# Altium schematic sheet OBC ARM.SchDoc
size A1; SheetNumber: 1; SheetTotal: 1
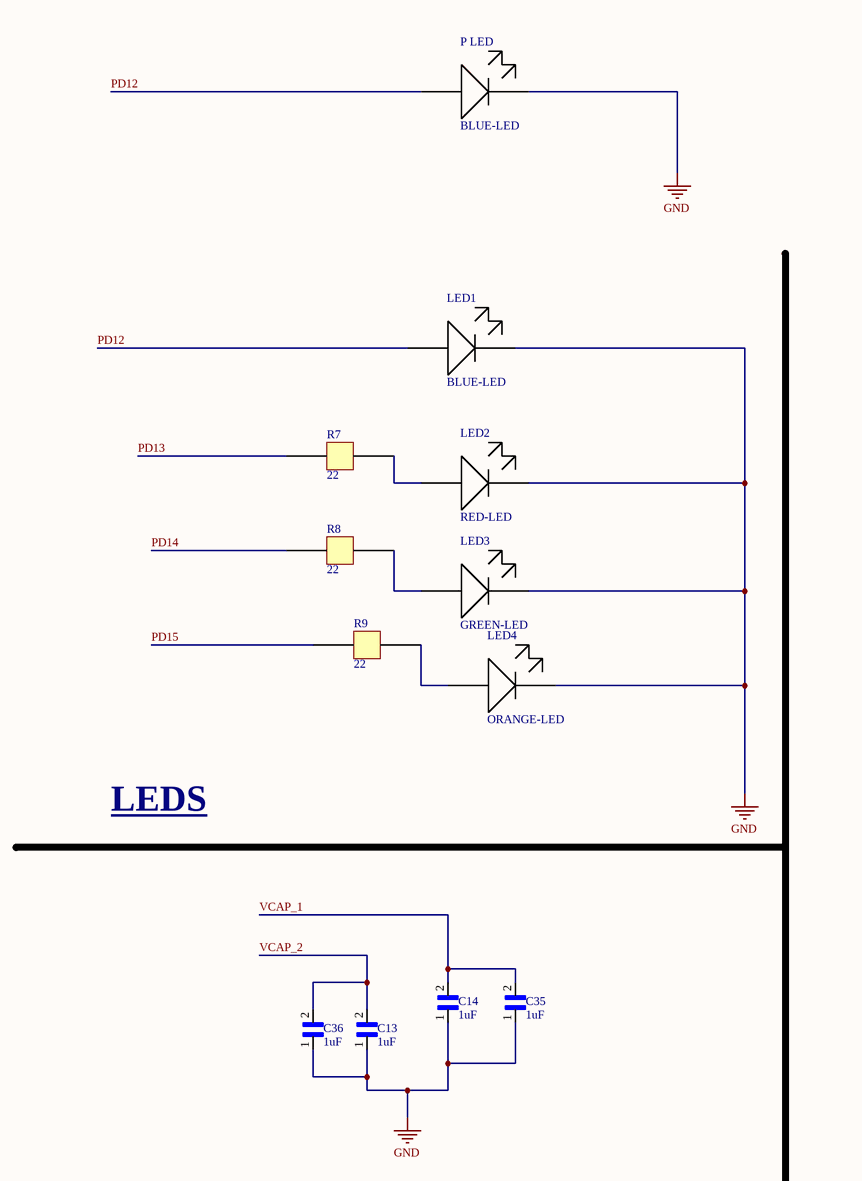
[diagram p0: OBC ARM.SchDoc, top left]
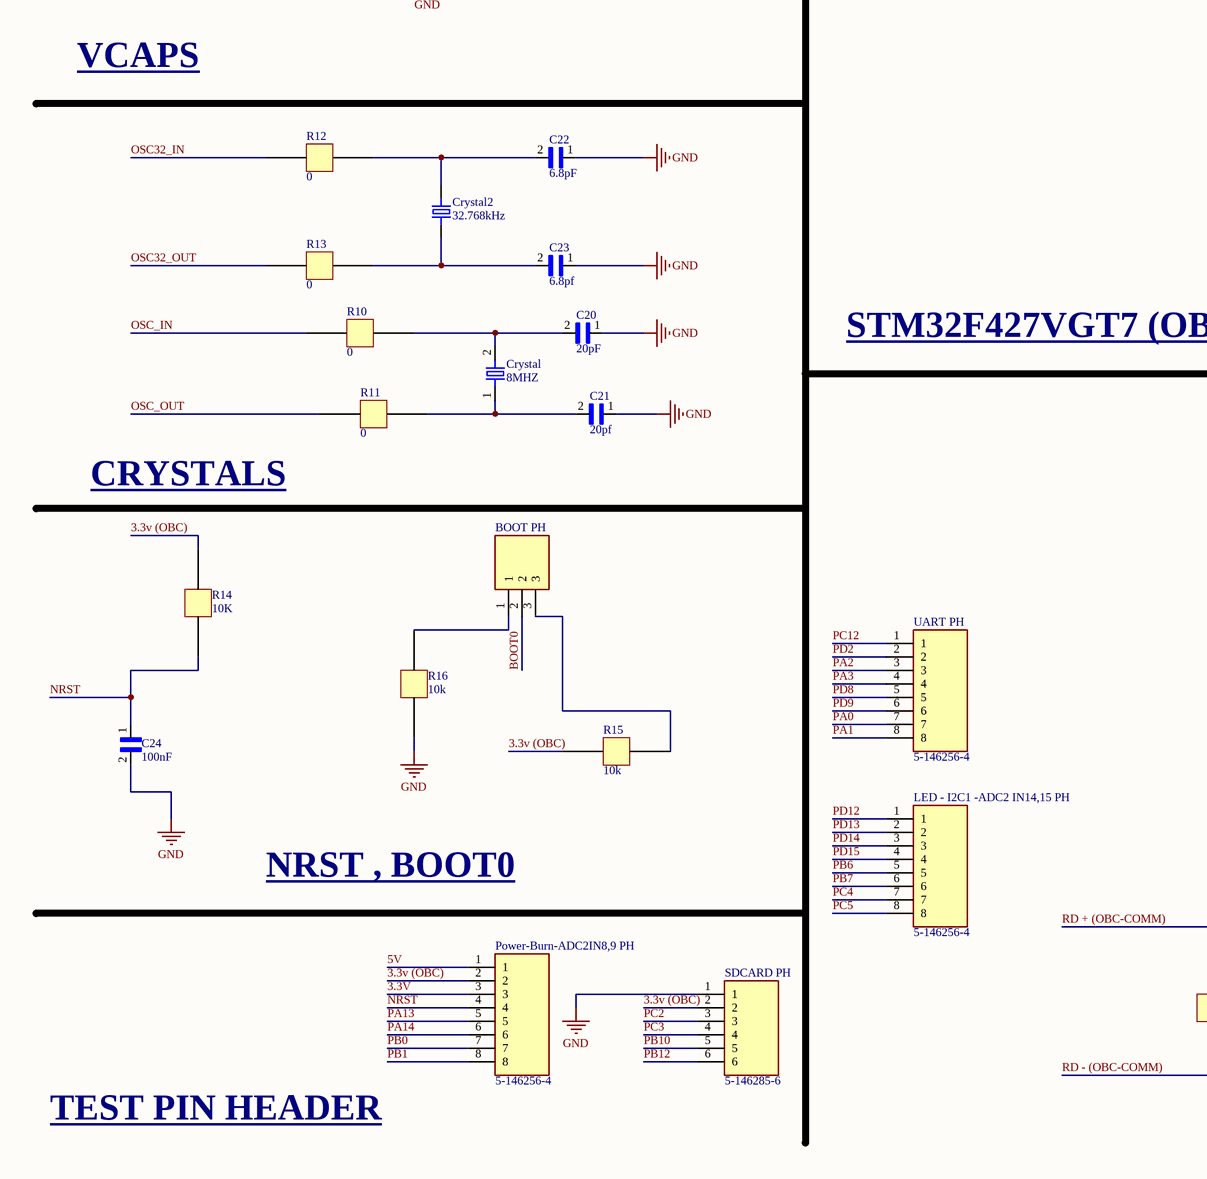
[diagram p1: OBC ARM.SchDoc, bottom left]
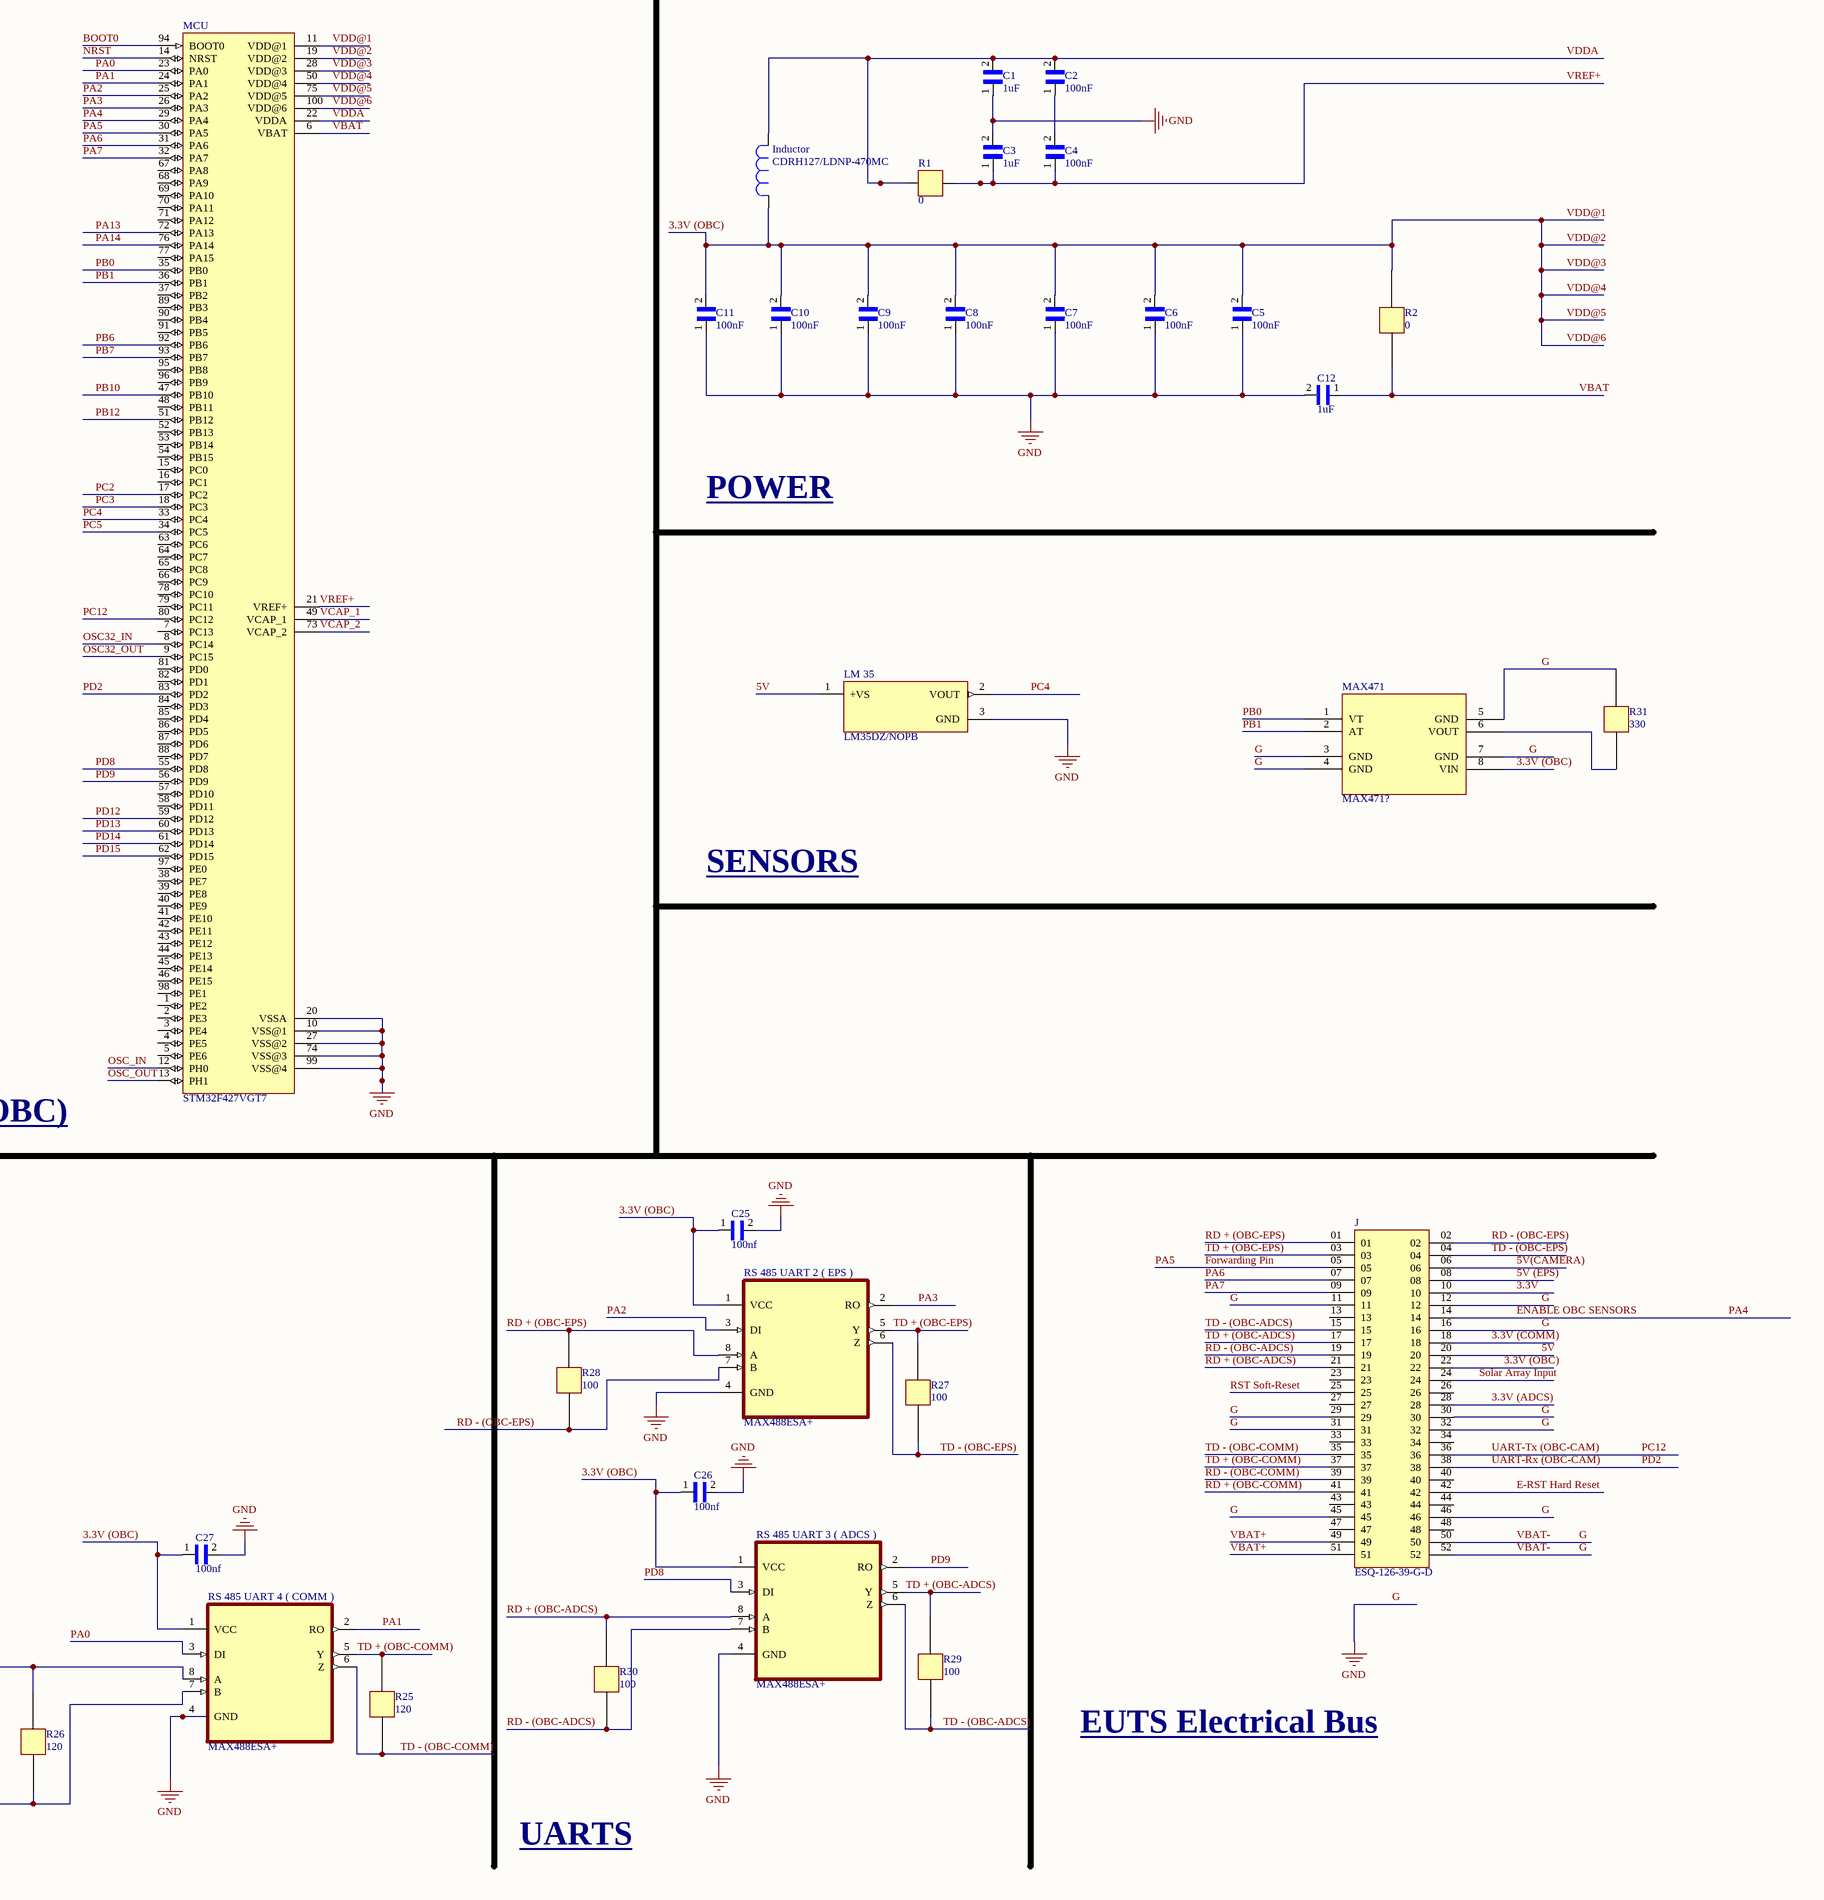
[diagram p2: OBC ARM.SchDoc, bottom right]

## Parts
BOOT_PH  4-103327-5  [TE_4-103327-5]  (value not drawn)
C1  1uF  [CAPC2012X95N]
C2  100nF  [CAPC2012X95N]
C3  1uF  [CAPC2012X95N]
C4  100nF  [CAPC2012X95N]
C5  100nF  [CAPC2012X95N]
C6  100nF  [CAPC2012X95N]
C7  100nF  [CAPC2012X95N]
C8  100nF  [CAPC2012X95N]
C9  100nF  [CAPC2012X95N]
C10  100nF  [CAPC2012X95N]
C11  100nF  [CAPC2012X95N]
C12  1uF  [CAPC2012X95N]
C13  1uF  [CAPC2012X95N]
C14  1uF  [CAPC2012X95N]
C20  20pF  [CAPC2012X95N]
C21  20pf  [CAPC2012X95N]
C22  6.8pF  [CAPC2012X95N]
C23  6.8pf  [CAPC2012X95N]
C24  100nF  [CAPC2012X95N]
C25  100nf  [CAPC2012X95N]
C26  100nf  [CAPC2012X95N]
C27  100nf  [CAPC2012X95N]
C35  1uF  [CAPC2012X95N]
C36  1uF  [CAPC2012X95N]
Crystal  8MHZ  [XTAL500X320X130N]
Crystal2  32.768kHz  [XTAL_ECS-.327-12.5-34S-TR]
Inductor  CDRH127/LDNP-470MC  [IND_CDRH127/LDNP-470MC_SUM]
J  ESQ-126-39-G-D  [SAMTEC_ESQ-126-39-G-D]
LED1  BLUE-LED  [RESC3015X65]
LED2  RED-LED  [RESC3015X65]
LED3  GREEN-LED  [RESC3015X65]
LED4  ORANGE-LED  [RESC3015X65]
LED_-_I2C1_-ADC2_IN14,15_PH  5-146256-4  [TE_5-146256-4]
LM_35  LM35DZ/NOPB  [TO92127P521H735-3]
MAX471  MAX471?  [PCBComponent_1]
MCU  STM32F427VGT7  [QFP50P1600X1600X160-100N]
P_LED  BLUE-LED  [RESC3015X65]
Power-Burn-ADC2IN8,9_PH  5-146256-4  [TE_5-146256-4]
R1  0  [CAPC2012X95N]
R2  0  [CAPC2012X95N]
R7  22  [CAPC2012X95N]
R8  22  [CAPC2012X95N]
R9  22  [CAPC2012X95N]
R10  0  [CAPC2012X95N]
R11  0  [CAPC2012X95N]
R12  0  [CAPC2012X95N]
R13  0  [CAPC2012X95N]
R14  10K  [CAPC2012X95N]
R15  10k  [CAPC2012X95N]
R16  10k  [CAPC2012X95N]
R25  120  [CAPC2012X95N]
R26  120  [CAPC2012X95N]
R27  100  [CAPC2012X95N]
R28  100  [CAPC2012X95N]
R29  100  [CAPC2012X95N]
R30  100  [CAPC2012X95N]
R31  330  [CAPC2012X95N]
RS_485_UART_2_(_EPS_)  MAX488ESA+  [SOIC127P600X175-8N]
RS_485_UART_3_(_ADCS_)  MAX488ESA+  [SOIC127P600X175-8N]
RS_485_UART_4_(_COMM_)  MAX488ESA+  [SOIC127P600X175-8N]
SDCARD_PH  5-146285-6  [TE_5-146285-6]
UART_PH  5-146256-4  [TE_5-146256-4]

## Nets
G: C1.1 C3.2 C5.1 C6.1 C7.1 C8.1 C9.1 C10.1 C11.1 C12.2 C13.1 C14.1 C20.1 C21.1 C22.1 C23.1 C24.2 C25.2 C26.2 C27.2 C35.1 C36.1 J.11 J.12 J.16 J.29 J.30 J.31 J.32 J.45 J.46 J.50 J.52 LED1.2 LED2.2 LED3.2 LED4.2 LM_35.3(GND) MAX471.3(GND) MAX471.4(GND) MAX471.5(GND) MAX471.7(GND) MCU.10(VSS@1) MCU.20(VSSA) MCU.27(VSS@2) MCU.74(VSS@3) MCU.99(VSS@4) P_LED.2 R16.2 R31.1 RS_485_UART_2_(_EPS_).4(GND) RS_485_UART_3_(_ADCS_).4(GND) RS_485_UART_4_(_COMM_).4(GND) SDCARD_PH.1  [also labelled GND, VBAT-]
3.3V: J.10 Power-Burn-ADC2IN8,9_PH.3
3.3V (ADCS): J.28
3.3V (COMM): J.18
3.3v (OBC): C5.2 C6.2 C7.2 C8.2 C9.2 C10.2 C11.2 C25.1 C26.1 C27.1 Inductor.2 J.22 MAX471.8(VIN) MCU.11(VDD@1) MCU.19(VDD@2) MCU.28(VDD@3) MCU.50(VDD@4) MCU.75(VDD@5) MCU.100(VDD@6) Power-Burn-ADC2IN8,9_PH.2 R2.1 R14.1 R15.2 RS_485_UART_2_(_EPS_).1(VCC) RS_485_UART_3_(_ADCS_).1(VCC) RS_485_UART_4_(_COMM_).1(VCC) SDCARD_PH.2  [also labelled VDD@1, VDD@2, VDD@3, VDD@4, VDD@5, VDD@6]
5V: J.20 LM_35.1(+VS) Power-Burn-ADC2IN8,9_PH.1
5V (EPS): J.08
5V(CAMERA): J.06
BOOT0: BOOT_PH.2 MCU.94(BOOT0)
E-RST Hard Reset: J.42
ENABLE OBC SENSORS: J.14 MCU.29(PA4)  [also labelled PA4]
Forwarding Pin: J.05 MCU.30(PA5)  [also labelled PA5]
NRST: C24.1 MCU.14(NRST) Power-Burn-ADC2IN8,9_PH.4 R14.2
OSC32_IN: MCU.8(PC14) R12.2
OSC32_OUT: MCU.9(PC15) R13.2
OSC_IN: MCU.12(PH0) R10.2
OSC_OUT: MCU.13(PH1) R11.2
PA0: MCU.23(PA0) RS_485_UART_4_(_COMM_).3(DI) UART_PH.7
PA1: MCU.24(PA1) RS_485_UART_4_(_COMM_).2(RO) UART_PH.8
PA2: MCU.25(PA2) RS_485_UART_2_(_EPS_).3(DI) UART_PH.3
PA3: MCU.26(PA3) RS_485_UART_2_(_EPS_).2(RO) UART_PH.4
PA6: J.07 MCU.31(PA6)
PA7: J.09 MCU.32(PA7)
PA13: MCU.72(PA13) Power-Burn-ADC2IN8,9_PH.5
PA14: MCU.76(PA14) Power-Burn-ADC2IN8,9_PH.6
PB0: MAX471.1(VT) MCU.35(PB0) Power-Burn-ADC2IN8,9_PH.7
PB1: MAX471.2(AT) MCU.36(PB1) Power-Burn-ADC2IN8,9_PH.8
PB6: LED_-_I2C1_-ADC2_IN14,15_PH.5 MCU.92(PB6)
PB7: LED_-_I2C1_-ADC2_IN14,15_PH.6 MCU.93(PB7)
PB10: MCU.47(PB10) SDCARD_PH.5
PB12: MCU.51(PB12) SDCARD_PH.6
PC2: MCU.17(PC2) SDCARD_PH.3
PC3: MCU.18(PC3) SDCARD_PH.4
PC4: LED_-_I2C1_-ADC2_IN14,15_PH.7 LM_35.2(VOUT) MCU.33(PC4)
PC5: LED_-_I2C1_-ADC2_IN14,15_PH.8 MCU.34(PC5)
PC12: J.36 MCU.80(PC12) UART_PH.1  [also labelled UART-Tx (OBC-CAM)]
PD2: J.38 MCU.83(PD2) UART_PH.2  [also labelled UART-Rx (OBC-CAM)]
PD8: MCU.55(PD8) RS_485_UART_3_(_ADCS_).3(DI) UART_PH.5
PD9: MCU.56(PD9) RS_485_UART_3_(_ADCS_).2(RO) UART_PH.6
PD12: LED1.1 LED_-_I2C1_-ADC2_IN14,15_PH.1 MCU.59(PD12) P_LED.1
PD13: LED_-_I2C1_-ADC2_IN14,15_PH.2 MCU.60(PD13) R7.2
PD14: LED_-_I2C1_-ADC2_IN14,15_PH.3 MCU.61(PD14) R8.2
PD15: LED_-_I2C1_-ADC2_IN14,15_PH.4 MCU.62(PD15) R9.2
RD + (OBC-ADCS): J.21 R30.1 RS_485_UART_3_(_ADCS_).8(A)
RD + (OBC-COMM): J.41 R26.1 RS_485_UART_4_(_COMM_).8(A)
RD + (OBC-EPS): J.01 R28.1 RS_485_UART_2_(_EPS_).8(A)
RD - (OBC-ADCS): J.19 R30.2 RS_485_UART_3_(_ADCS_).7(B)
RD - (OBC-COMM): J.39 R26.2 RS_485_UART_4_(_COMM_).7(B)
RD - (OBC-EPS): J.02 R28.2 RS_485_UART_2_(_EPS_).7(B)
RST Soft-Reset: J.25
Solar Array Input: J.24
TD + (OBC-ADCS): J.17 R29.1 RS_485_UART_3_(_ADCS_).5(Y)
TD + (OBC-COMM): J.37 R25.1 RS_485_UART_4_(_COMM_).5(Y)
TD + (OBC-EPS): J.03 R27.1 RS_485_UART_2_(_EPS_).5(Y)
TD - (OBC-ADCS): J.15 R29.2 RS_485_UART_3_(_ADCS_).6(Z)
TD - (OBC-COMM): J.35 R25.2 RS_485_UART_4_(_COMM_).6(Z)
TD - (OBC-EPS): J.04 R27.2 RS_485_UART_2_(_EPS_).6(Z)
VBAT: C12.1 MCU.6(VBAT) R2.2
VBAT+: J.49 J.51
VCAP_1: C14.2 C35.2 MCU.49(VCAP_1)
VCAP_2: C13.2 C36.2 MCU.73(VCAP_2)
VDDA: C1.2 C2.2 Inductor.1 MCU.22(VDDA) R1.2
VREF+: C3.1 C4.1 MCU.21(VREF+) R1.1
NetBOOT_PH_1: BOOT_PH.1 R16.1
NetBOOT_PH_3: BOOT_PH.3 R15.1
NetC2_1: C2.1 C4.2
NetC20_2: C20.2 Crystal.2 R10.1
NetC21_2: C21.2 Crystal.1 R11.1
NetC22_2: C22.2 Crystal2.2(OUT/IN) R12.1
NetC23_2: C23.2 Crystal2.1(IN/OUT) R13.1
NetLED2_1: LED2.1 R7.1
NetLED3_1: LED3.1 R8.1
NetLED4_1: LED4.1 R9.1
NetMAX471_6: MAX471.6(VOUT) R31.2

Not connected (* = marked no-connect by the designer): J 13 23 26 27 33 34 40 43 44 47 48; MCU 1(PE2) 2(PE3) 3(PE4) 4(PE5) 5(PE6) 7(PC13) 15(PC0) 16(PC1) 37(PB2) 38(PE7) 39(PE8) 40(PE9) 41(PE10) 42(PE11) 43(PE12) 44(PE13) 45(PE14) 46(PE15) 48(PB11) 52(PB13) 53(PB14) 54(PB15) 57(PD10) 58(PD11) 63(PC6) 64(PC7) 65(PC8) 66(PC9) 67(PA8) 68(PA9) 69(PA10) 70(PA11) 71(PA12) 77(PA15) 78(PC10) 79(PC11) 81(PD0) 82(PD1) 84(PD3) 85(PD4) 86(PD5) 87(PD6) 88(PD7) 89(PB3) 90(PB4) 91(PB5) 95(PB8) 96(PB9) 97(PE0) 98(PE1)

## Notes on the sheet
- LEDS
- POWER
- VCAPS
- SENSORS
- STM32F427VGT7 (OBC)
- CRYSTALS
- NRST , BOOT0
- EUTS Electrical Bus
- TEST PIN HEADER
- UARTS

## Library data of the parts
BOOT_PH = 4-103327-5: Conn Unshrouded Header HDR 3 POS 2.54mm Solder ST Thru-Hole Carton; MF: TE Connectivity; Package: None; Value: *; TE_purchase_URL: https://www.te.com/usa-en/product-4-103327-5.html?te_bu=Cor&te_type=disp&te_campaign=seda_glo_cor-seda-global-disp-prtnr-fy19-seda-model-bom-cta_sma-317_1&elqCampaignId=32493; Price: None; MP: 4-103327-5; SnapEDA_Link: https://www.snapeda.com/parts/4-103327-5/TE%20Connectivity%20AMP%20Connectors/view-part/2403997/?ref=snap; Availability: Unavailable; EU_RoHS_Compliance: Compliant
C1-C14 C20-C27 C35 C36 = UMK212SD103KD-T: CAP CER 10000PF 50V 0805; Package: None; Price: None; Value: *; MP: UMK212SD103KD-T; Availability: Unavailable
Crystal = ABM3-8.000MHZ-D2Y-T: 8MHz Â±20ppm Crystal 18pF 140 Ohms 2-SMD, No Lead; MF: Abracon; Value: *; MP: ABM3-8.000MHZ-D2Y-T; SnapEDA_Link: https://www.snapeda.com/parts/ABM3-8.000MHZ-D2Y-T/Abracon%20LLC/view-part/106372/?ref=snap; Package: SMD-2 Abracon; Digi-Key_Part_Number: 535-10630-1-ND; Digi-Key_Purchase_URL: https://www.digikey.com/product-detail/en/abracon-llc/ABM3-8.000MHZ-D2Y-T/535-10630-1-ND/2344632?utm_source=snapeda&utm_medium=aggregator&utm_campaign=symbol
Crystal2 = ECS-.327-12.5-34S-TR: 32.768kHz Â±20ppm Crystal 12.5pF 70 kOhms 2-SMD, No Lead; MF: ECS Inc.; MP: ECS-.327-12.5-34S-TR; Value: *; Availability: Unavailable; SnapEDA_Link: https://www.snapeda.com/parts/ECS-.327-12.5-34S-TR/ECS%20Inc./view-part/2454548/?ref=snap; Price: None; Package: SMD-2 ECS International
Inductor = CDRH127/LDNP-470MC: 47ÂµH Shielded Inductor 3.25A 78mOhm Max Nonstandard; MF: Sumida America; Digi-Key_Part_Number: 308-1339-1-ND; Check_prices: https://www.snapeda.com/parts/CDRH127/LDNP-470MC/Sumida%20America%20Components%20Inc./view-part/547921/?ref=eda; Package: Nonstandard Sumida; Value: *; MP: CDRH127/LDNP-470MC; SnapEDA_Link: https://www.snapeda.com/parts/CDRH127/LDNP-470MC/Sumida%20America%20Components%20Inc./view-part/547921/?ref=snap; Purchase-URL: https://pricing.snapeda.com/search/part/CDRH127/LDNP-470MC/?ref=eda
J = ESQ-126-39-G-D: 52 Position Elevated Socket Connector Through Hole; MF: Samtec; Package: None; MP: ESQ-126-39-G-D; Value: *; Availability: Unavailable; Price: None; SnapEDA_Link: https://www.snapeda.com/parts/ESQ-126-39-G-D/Samtec%20Inc./view-part/490181/?ref=snap
LED1-LED4 P_LED = LTST-C150TBKT: LED Blue 470nm LED Indication 3.3V
LED_-_I2C1_-ADC2_IN14,15_PH Power-Burn-ADC2IN8,9_PH UART_PH = 5-146256-4: 08 MODII HDR DRST B/A .100CL LF; MF: TE Connectivity; Package: None; Availability: Unavailable; Value: *; MP: 5-146256-4; Price: None; SnapEDA_Link: https://www.snapeda.com/parts/5-146256-4/TE%20Connectivity%20AMP%20Connectors/view-part/500529/?ref=snap
LM_35 = LM35DZ/NOPB: Temperature Sensor Analog, Local 0Â°C ~ 100Â°C 10mV/Â°C TO-92-3; MF: Texas Instruments; MP: LM35DZ; Value: *; SnapEDA_Link: https://www.snapeda.com/parts/LM35DZ/Texas+Instruments/view-part/?ref=snap; Price: None; Availability: Not in stock; Package: E-PKG AXIAL-LEADED-2 ON Semiconductor; Check_prices: https://www.snapeda.com/parts/LM35DZ/Texas+Instruments/view-part/?ref=eda
MAX471 = MAX471?: MAX471 Voltage And Current Sensor Module Consume Voltage Load Detection Module
MCU = STM32F427VGT7: ARMÂ® CortexÂ®-M4 STM32F4 Microcontroller IC 32-Bit 180MHz 1MB _1M x 8_ FLASH 100-LQFP _14x14_; MF: STMicroelectronics; Package: LQFP-100 STMicroelectronics; Availability: Unavailable; Value: *; MP: STM32F427VGT7; SnapEDA_Link: https://www.snapeda.com/parts/STM32F427VGT7/STMicroelectronics/view-part/567621/?ref=snap; Price: None
R1 R2 R7-R16 R25-R31 = RESISTOR
RS_485_UART_2_(_EPS_) RS_485_UART_3_(_ADCS_) RS_485_UART_4_(_COMM_) = MAX488ESA+: 1/1 Transceiver Full RS422, RS485 8-SOIC; MP: MAX488ESA+T; MF: Maxim Integrated; Price: None; Package: SOIC-8 Maxim; Availability: Unavailable; SnapEDA_Link: https://www.snapeda.com/parts/MAX488ESA+T/Maxim%20Integrated/view-part/48834/?ref=snap; Value: *
SDCARD_PH = 5-146285-6: Connector Header Through Hole 6 position 0.100 (2.54mm); MF: TE Connectivity; DigiKey-Purchase-URL: https://snapeda.com/shop?store=DigiKey&id=2411669; EU_RoHS_Compliance: Compliant; Package: None; MP: 5-146285-6; Value: *; SnapEDA_Link: https://www.snapeda.com/parts/5-146285-6/TE%20Connectivity%20AMP%20Connectors/view-part/2411669/?ref=snap; Digi-Key_Part_Number: A122872-ND